# Altium schematic sheet H01R0_Frontend.SchDoc
size Letter; CompanyName: Hexabitz; DocumentNumber: 3; SheetNumber: 2; SheetTotal: 2
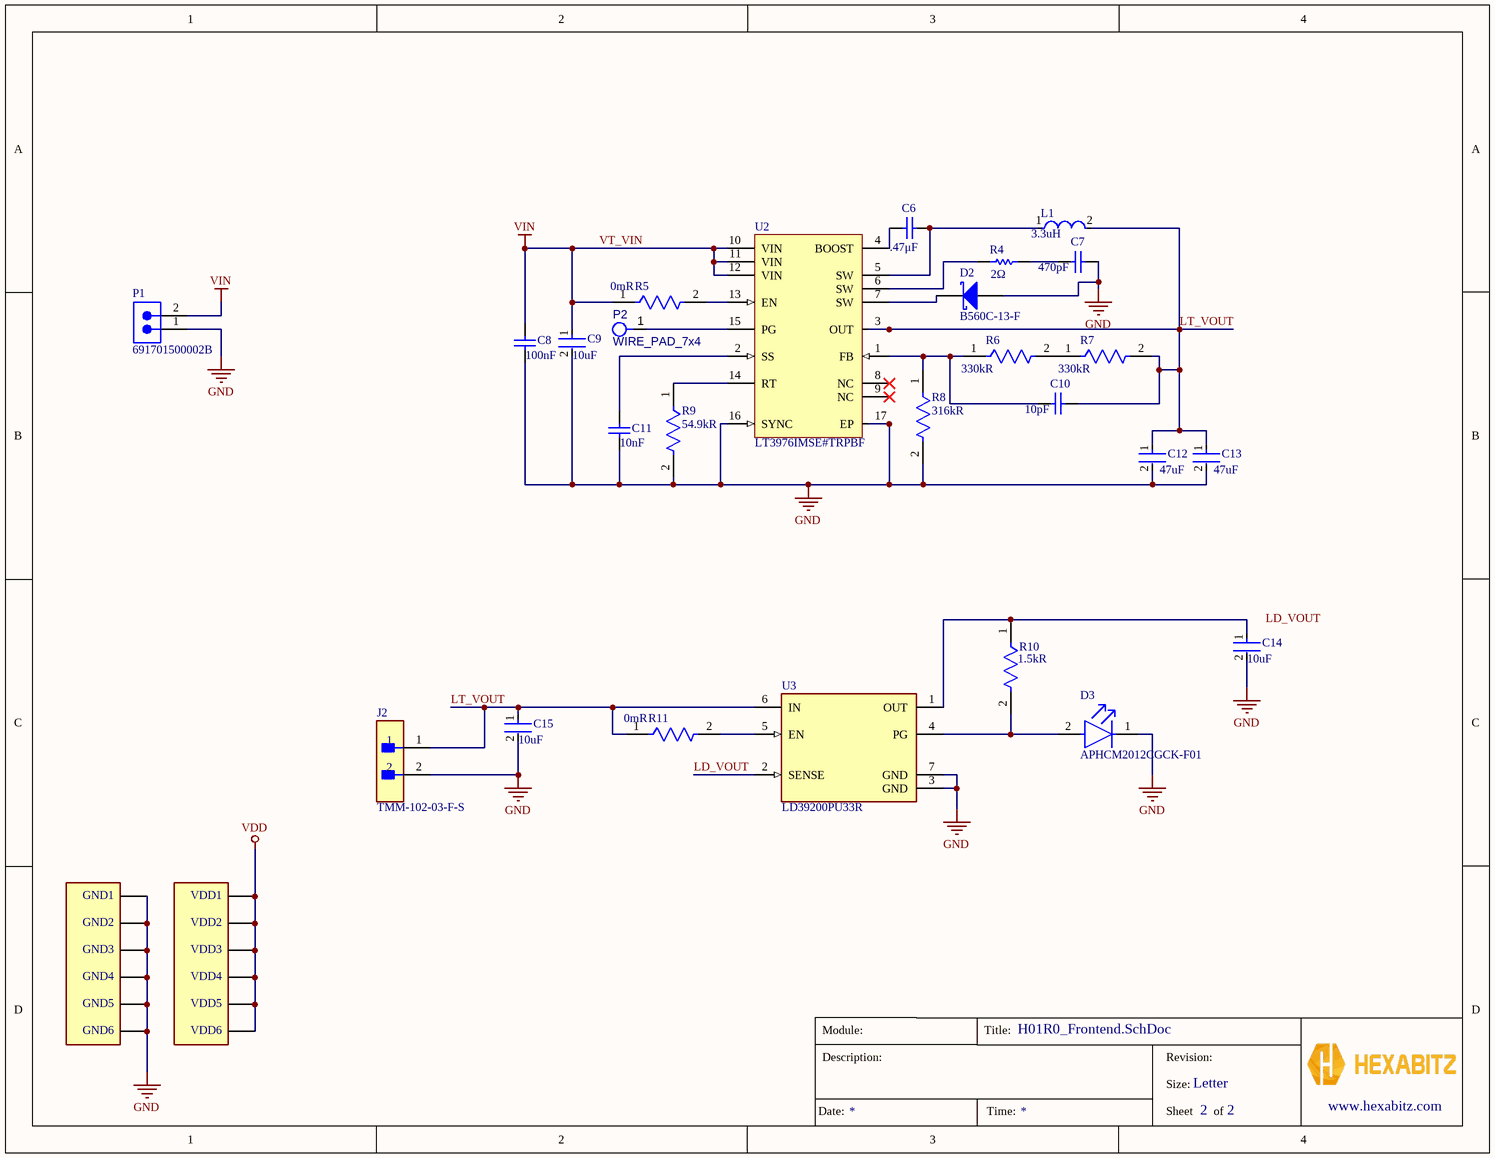
[diagram p0: H01R0_Frontend.SchDoc]

## Parts
C6  Capacitance: .47μF  [CAPC2013X145X50LL20T20]  (hidden comment: VJ0805Y474KXQRW1BC)
C7  Capacitance: 470pF  [CAPC2013X94X50NL20T25]  (hidden comment: 08055C471KAT4A)
C8  Capacitance: 100nF  [CAPC2013X94X50NL20T25]  (hidden comment: 08055C104KAZ2A)
C9  Capacitance: 10uF  [FP-GRM32-MFG]  (hidden comment: GRM32ER71H106KA12L)
C10  Capacitance: 10pF  [CAPC2013X94X50LL20T25]  (hidden comment: 08051A100JAT4A)
C11  Capacitance: 10nF  [CAPC2013X94X50ML20T25]  (hidden comment: 0805YC103MAT2A)
C12  Capacitance: 47uF  [FP-GRM32E-0_3-0_2-MFG]  (hidden comment: GRM32ED71A476KE15L)
C13  Capacitance: 47uF  [FP-GRM32E-0_3-0_2-MFG]  (hidden comment: GRM32ED71A476KE15L)
C14  Capacitance: 10uF  [FP-GRM32-MFG]  (hidden comment: GRM32ER71H106KA12L)
C15  Capacitance: 10uF  [FP-GRM32-MFG]  (hidden comment: GRM32ER71H106KA12L)
D2  B560C-13-F  [DIOD-B5X0C-2_M]
D3  APHCM2012CGCK-F01  [FP-APHCM2012CGCK-F01-MFG]
GND1  HEXABIT_UART_PORT  [HEXABIT_POWER_PORT_D]  (value not drawn)  (no BOM)
GND2  HEXABIT_UART_PORT  [HEXABIT_POWER_PORT_D]  (value not drawn)  (no BOM)
GND3  HEXABIT_UART_PORT  [HEXABIT_POWER_PORT_D]  (value not drawn)  (no BOM)
GND4  HEXABIT_UART_PORT  [HEXABIT_POWER_PORT_D]  (value not drawn)  (no BOM)
GND5  HEXABIT_UART_PORT  [HEXABIT_POWER_PORT_D]  (value not drawn)  (no BOM)
GND6  HEXABIT_UART_PORT  [HEXABIT_POWER_PORT_D]  (value not drawn)  (no BOM)
J2  TMM-102-03-F-S  [FP-TMM-102-03-F-S-MFG]
L1  Inductance: 3.3uH  [FP-MLZ2012-0_85-IPC_C]  (hidden comment: MLZ2012A3R3WT000)
P1  691701500002B  [691701500002B]
P2  WIRE_PAD_7x4  [WIRE_PAD_7x4-Footprint-1]  (no BOM)
R4  Resistance: 2Ω  [RESC2013X50X30NL20T20]  (hidden comment: CRCW08052R00FNEA)
R5  Resistance: 0mR  [FP-RMCF0805-MFG]  (hidden comment: RMCF0805ZT0R00)
R6  Resistance: 330kR  [FP-CRCW0805-e3-MFG]  (hidden comment: CRCW0805330KFKEA)
R7  Resistance: 330kR  [FP-CRCW0805-e3-MFG]  (hidden comment: CRCW0805330KFKEA)
R8  Resistance: 316kR  [FP-RC2012-IPC_C]  (hidden comment: RC2012F3163CS)
R9  Resistance: 54.9kR  [FP-CR0805-MFG]  (hidden comment: CR0805-FX-5492ELF)
R10  Resistance: 1.5kR  [FP-RMCF0805-IPC_A]  (hidden comment: RMCF0805JT1K50)
R11  Resistance: 0mR  [FP-RMCF0805-MFG]  (hidden comment: RMCF0805ZT0R00)
U2  LT3976IMSE#TRPBF  [LT-MSE-16-EDP_M]
U3  LD39200PU33R  [FP-DFN6-7946637-MFG]
VDD1  HEXABIT_UART_PORT  [HEXABIT_POWER_PORT_U]  (value not drawn)  (no BOM)
VDD2  HEXABIT_UART_PORT  [HEXABIT_POWER_PORT_U]  (value not drawn)  (no BOM)
VDD3  HEXABIT_UART_PORT  [HEXABIT_POWER_PORT_U]  (value not drawn)  (no BOM)
VDD4  HEXABIT_UART_PORT  [HEXABIT_POWER_PORT_U]  (value not drawn)  (no BOM)
VDD5  HEXABIT_UART_PORT  [HEXABIT_POWER_PORT_U]  (value not drawn)  (no BOM)
VDD6  HEXABIT_UART_PORT  [HEXABIT_POWER_PORT_U]  (value not drawn)  (no BOM)

## Nets
GND: C7.2 C8.2 C9.2 C11.2 C12.2 C13.2 C14.2 C15.2 D2.2(A) D3.1(C) GND1.Pwr_D GND2.Pwr_D GND3.Pwr_D GND4.Pwr_D GND5.Pwr_D GND6.Pwr_D J2.2 P1.1 R8.2 R9.2 U2.16(SYNC) U2.17(EP) U3.3(GND) U3.7(GND)
VDD: VDD1.Pwr_U VDD2.Pwr_U VDD3.Pwr_U VDD4.Pwr_U VDD5.Pwr_U VDD6.Pwr_U
VT_VIN: C8.1 C9.1 P1.2 R5.1 U2.10(VIN) U2.11(VIN) U2.12(VIN)  [also labelled VIN]
LD_VOUT: U3.2(SENSE)
LT_VOUT: C10.2 C12.1 C13.1 C15.1 J2.1 L1.2 R7.2 R11.1 U2.3(OUT) U3.6(IN)
NetC6_1: C6.1 L1.1 U2.5(SW)
NetC6_2: C6.2 U2.4(BOOST)
NetC7_1: C7.1 R4.1
NetC10_1: C10.1 R6.1 R8.1 U2.1(FB)
NetC11_1: C11.1 U2.2(SS)
NetC14_1: C14.1 R10.1 U3.1(OUT)
NetD2_1: D2.1(K) U2.7(SW)
NetD3_2: D3.2(A) R10.2 U3.4(PG)
NetP2_1: P2.1(H1) U2.15(PG)
NetR4_2: R4.2 U2.6(SW)
NetR5_2: R5.2 U2.13(EN)
NetR6_2: R6.2 R7.1
NetR9_1: R9.1 U2.14(RT)
NetR11_2: R11.2 U3.5(EN)

Not connected (* = marked no-connect by the designer): U2 8(NC)* 9(NC)*

## Notes on the sheet
- (near C14) R_LED ≈ (3.3 – V_F)/I ≈ (3.3 – 2.1)/1 mA ≈ 1.2 kΩ → use 1.5 kΩ
- Labels drawn without touching a wire or pin: LD_VOUT
- Module:
- Title:
- Description:
- Size:
- Revision:
- Letter
- www.hexabitz.com
- Date:
- Time:
- Sheet
- of

## Library data of the parts
C6 = CMP-2007-01617-1: Manufacturer: Vitramon; Part Number: VJ0805Y474KXQRW1BC
C7 = CMP-2007-04419-1: Manufacturer: AVX Interconnect / Elco; Part Number: 08055C471KAT4A
C8 = CMP-2007-04372-1: Manufacturer: AVX Interconnect / Elco; Part Number: 08055C104KAZ2A
C9 C14 C15 = CMP-2000-05261-2: CAP CER 10UF 50V X7R 1210; Manufacturer: Murata; Tolerance: 10%; Description: 10µF ±10% 50V Ceramic Capacitor X7R 1210 (3225 Metric); Material: Ceramic; Temperature Coefficient: 15%; Voltage Rating: 50V; Temperature Characteristic: X7R; Value: 10uF; ComponentLink2Description: Datasheet; Device Class L1: Passive Components; Lead Free: Yes; Temperature Range High: +125°C; Category: Cap; Manufacturer Part Number: GRM32ER71H106KA12L; ComponentLink2URL: https://search.murata.co.jp/Ceramy/image/img/A01X/G101/ENG/GRM32ER71H106KA12-01.pdf; Device Class L2: Capacitors; Package: GRM32; Mouser Description: 1210 10 uF 50 V ±10% Tolerance X7R SMT Multilayer Ceramic Capacitor; Octopart: https://octopart.com/grm32er71h106ka12l-murata-10470987; Digikey Description: CAP CER 10UF 50V X7R 1210; Height: 2.7mm; Temperature: -55°C to +125°C; Temperature Range Low: -55°C; RoHS: TRUE; Device Class L3: Ceramic Capacitors; Automotive: No
C10 = CMP-2007-04117-1: Manufacturer: AVX Interconnect / Elco; Part Number: 08051A100JAT4A
C11 = CMP-2007-04453-1: Manufacturer: AVX Interconnect / Elco; Part Number: 0805YC103MAT2A
C12 C13 = CMP-06035-032018-1: Chip Multilayer Ceramic Capacitors for General Purpose, 1210, 47uF, X7T, +22%/-33%, 10%, 10V; Packaging: Tape and Reel; Package Quantity: 1000; Mount: Surface Mount; Thickness: 0.106inch; Max Operating Temperature: 125°C; Dielectric: X7T; Weight: 0.00388oz; Voltage Rating (DC): 10V; Termination: SMD/SMT; Case Code (Metric): 3225; Case/Package: 1210; Case Code (Imperial): 1210; Min Operating Temperature: -55°C; Width: 0.098inch; Tolerance: 10%; Length: 0.126inch; Height: 2.5mm; Voltage Rating: 10V
D2 = CMP-2000-05098-2: Schottky Barrier Rectifier, 5 A, 60 V, -55 to 125 degC, 2-Pin SMD, RoHS, Tape and Reel; Ir - Reverse Current: 500uA; Configuration: Single; Ifsm - Forward Surge Current: 100A; Vrrm - Repetitive Reverse Voltage: 60V; Brand: DiodesIncorporated; Vf - Forward Voltage: 0.7V; If - Forward Current: 5A; Unit Weight: 0.007408oz; Type: SchottkyBarrierRectifier; Package / Case: SMC; Manufacturer URL: http://www.diodes.com/; Datasheet URL: https://datasheet.ciiva.com/27052/1538961-27052355.pdf; Factory Pack Quantity: 3000; Height: 2.5mm; Width: 6.22mm; Product Category: SchottkyDiodes&Rectifiers; Minimum Operating Temperature: -55C; Manufacturer: DiodesIncorporated; Datasheet Version: Rev. 7-2, 06/2007; Product: SchottkyDiodes; Maximum Operating Temperature: +125C; Operating Temperature Range: -55Cto+125C; Technology: Si; Length: 7.11mm; RoHS: True; Packaging: Reel; Termination Style: SMD/SMT; Series: B560; Mounting Style: SMD/SMT
D3 = CMP-44529-000062-1: LED GREEN CLEAR CHIP SMD; Dominant Wavelength: 570nm; Forward Current: 20mA; Number of LEDs: 1; Luminous Intensity: 40mcd; Forward Voltage: 2.1V; Viewing Angle: 110°; Illumination Color: Green; Lens Style: Clear; Mount: Surface Mount; Length: 2mm; Max Operating Temperature: 85°C; Series: APHCM; Width: 1.25mm; Lead Free: Lead Free; Wavelength: 570nm; Package Quantity: 1; Number of Pins: 2; Case Code (Metric): 2012; RoHS Compliant: Yes; Packaging: Tape and Reel; Lens Color: Clear; Case/Package: 0805; Case Code (Imperial): 0805; Test Current: 20mA; Color: Green; Min Operating Temperature: -40°C; Height: 0.4mm
GND1-GND6 = HEXABIT_POWER_PORT_D
J2 = CMP-02766-001614-1: CONN HEADER VERT 2POS 2MM; Number of Contacts: 2; Gender: Male; Pitch: 2mm; Packaging: Bulk; RoHS Compliant: Yes; Termination: Solder; Contact Plating: Gold; Mount: Through Hole; Number of Rows: 1; Radiation Hardening: No; Lead Free: Lead Free
L1 = CMP-08253-000308-1: Shielded Multilayer Inductor 3.3uH ±20% 450mA 442mΩ SMD 0805; Saturation Current: 200mA; Self Resonant Frequency: 90MHz; DC Resistance (DCR): 442mR; Core Material: Ferrite; Test Frequency: 10MHz; Current Rating: 450mA; Shielding: Shielded; Lead Free: Lead Free; Length: 0.079inch; Max Operating Temperature: 125°C; Height - Seated (Max): 0.041inch; Tolerance: 20%; Mount: Surface Mount; Package Quantity: 1; Case/Package: 0805; Case Code (Metric): 2012; Min Operating Temperature: -55°C; Packaging: Cut Tape; RoHS Compliant: Yes; Case Code (Imperial): 0805; Width: 0.049inch
P1 = CMP-1502-02318-2: NexarPartId: 22866741; Voltage Rating: 300V; Connector Type: Terminal Block; Gender: Male; Pitch: 5.08mm; Number of Contacts: 2; Current Rating: 10A; Length: 9.76mm; Contact Plating: Tin; Contact Gender: Male; RoHS: Compliant; Max Operating Temperature: 105°C; Mount: Through Hole; REACH SVHC: Unknown; Housing Material: Polymer; Lead Pitch: 5.08mm; Min Operating Temperature: -40°C; Termination: PCB; Number of Pins: 2; Color: Black; Contact Material: Brass
P2 = CMP-019-00043-3: SMD WIRE PAD 7 x 4 mm; Pins: 1
R4 = CMP-2001-03791-1: Manufacturer: Vishay Dale; Part Number: CRCW08052R00FNEA
R5 R11 = CMP-26527-000017-1: RES 0 OHM JUMPER 1/8W 0805; Power Rating: 125mW; Depth: 1.25mm; Length: 2mm; Military Standard: Not; Width: 0.049inch; Case Code (Imperial): 0805; Number of Terminations: 2; Mount: Surface Mount; Contact Plating: Tin; Height: 0.026inch; Case/Package: 0805; Min Operating Temperature: -55°C; Composition: Thick Film; Max Operating Temperature: 155°C; Packaging: Tape and Reel; Features: Automotive AEC-Q200; Max Power Dissipation: 125mW; Radiation Hardening: No; Lead Free: Lead Free; Case Code (Metric): 2012
R6 R7 = CMP-2001-03821-2: RES Thick Film, 330kΩ, 1%, 0.125W, 100ppm/°C, 0805; Power Rating: 125mW; Voltage Rating (DC): 150V; Case Code (Metric): 2012; Contact Plating: Tin; Composition: Thick Film; Length: 2mm; Radiation Hardening: No; Height: 0.45mm; Max Operating Temperature: 155°C; Lead Free: Lead Free; Packaging: Tape and Reel; Depth: 1.25mm; Tolerance: 1%; Width: 1.25mm; Termination: SMD/SMT; Case Code (Imperial): 0805; Case/Package: 0805; Voltage Rating: 150V; Weight: 0.000194oz; Package Quantity: 5000; Temperature Coefficient: 100ppm/°C; Military Standard: Not; Min Operating Temperature: -55°C
R8 = CMP-13261-004620-1: Res Thick Film 0805 316kΩ 1% 0.125W ±100ppm/°C Molded SMD T/R; Voltage Rating (DC): 150V; Power Rating: 125mW; Contact Plating: Tin; Lead Free: Lead Free; Military Standard: Not; Temperature Coefficient: 100ppm/°C; Case Code (Imperial): 0805; Number of Terminations: 2; Width: 0.049inch; Radiation Hardening: No; Packaging: Tape and Reel; Composition: Thick Film; Case Code (Metric): 2012; Min Operating Temperature: -55°C; Max Operating Temperature: 155°C; Features: Moisture Resistant; Depth: 1.25mm; Length: 2mm; Height: 0.024inch; Tolerance: 1%; Case/Package: 0805; Max Power Dissipation: 125mW
R9 = CMP-07231-002869-1: Thick Film Chip Resistors 0805 54.9kΩ 0.125W 1% 100ppm/°C; Voltage Rating: 150V; Power Rating: 125mW; Contact Plating: Tin; Thickness: 508um; Military Standard: Not; Height: 0.5mm; Max Operating Temperature: 155°C; Radiation Hardening: No; Composition: Thick Film; Case Code (Metric): 2012; Depth: 1.25mm; Case Code (Imperial): 0805; Length: 2mm; Case/Package: 0805; Termination: SMD/SMT; Width: 1.25mm; Temperature Coefficient: 100ppm/°C; Min Operating Temperature: -55°C; Packaging: Tape and Reel; Tolerance: 1%; Mount: Surface Mount; Package Quantity: 5000
R10 = CMP-26527-000060-1: 1.5kΩ ±5% 0.125W 0805 Thick Film Chip Resistor AEC-Q200 compliant; Power Rating: 125mW; Temperature Coefficient: 100ppm/°C; Tolerance: 5%; Radiation Hardening: No; Width: 0.049inch; Mount: Surface Mount; RoHS Compliant: Yes; Length: 0.079inch; Series: RMCF; Case Code (Metric): 2012; Contact Plating: Tin; Size Code: 0805; Resistor Type: Thick Film; Construction: Rectangular; Case/Package: 0805; Min Operating Temperature: -55°C; Max Power Dissipation: 125mW; Lead Free: Lead Free; Height: 0.026inch; Features: Automotive AEC-Q200; Number of Terminations: 2; Depth: 1.25mm; Packaging: Tape and Reel; Max Operating Temperature: 155°C; Military Standard: Not; Case Code (Imperial): 0805
U2 = CMP-019-00049-1: LT3976 - 40V, 5A, 2MHz Step-Down Switching Regulator with 3.3μA Quiescent Current; Output Voltage: 38.8V; Pins: 16; Output Current: 5A; Max Operating Temperature: 125°C; Min Operating Temperature: -40°C
U3 = CMP-12153-000011-1: IC REG LINEAR 3.3V 2A 6DFN; Number of Outputs: 1; Max Input Voltage: 6V; Output Type: Fixed; Min Input Voltage: 1.25V; Dropout Voltage: 130mV; Operating Supply Current: 1mA; Number of Regulators: 1; Case/Package: DFN; Packaging: Tape and Reel; Output Current: 2A; Min Operating Temperature: -40°C; Mount: Surface Mount; Output Voltage: 3.3V; Max Operating Temperature: 125°C; Lead Free: Lead Free; Package Quantity: 3000
VDD1-VDD6 = HEXABIT_POWER_PORT_U